# EAGLE design Adafruit MPU6050 (EAGLE 9.6.2)
COMPANY: ADAFRUIT INDUSTRIES; DRAWN: KTOWN; REV: A; YEAR: 2019
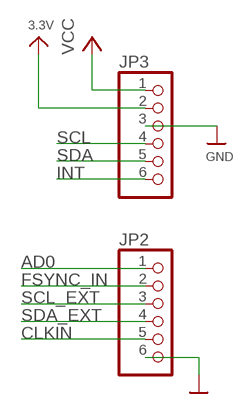
[diagram p0: schematic, sheet 1]

## Parts
JP2  HEADER-1X6ROUND  [1X06_ROUND]
JP3  HEADER-1X670MIL  [1X06_ROUND_70]

## Nets
3.3V: JP3.2
AD0: JP2.1
CLKIN: JP2.5
FSYNC_IN: JP2.2
GND: JP2.6 JP3.3
INT: JP3.6
SCL: JP3.4
SCL_EXT: JP2.3
SDA: JP3.5
SDA_EXT: JP2.4
VCC [highpower]: JP3.1

## Library data of the parts
JP2 JP3 = microbuilder:HEADER-1X6: PIN HEADER

## Net classes
1 highpower: width 0.406 mm, drill 0.483 mm
2 lowpower: width 0.305 mm, drill 0.483 mm

## Board
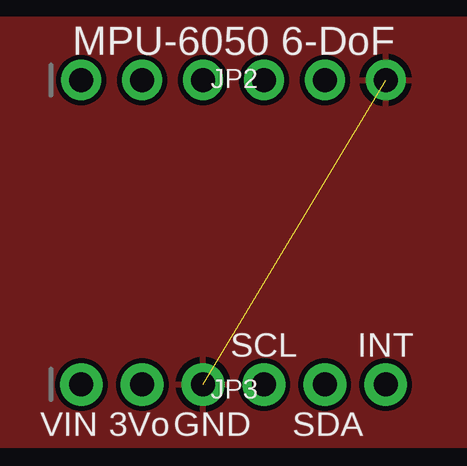
[diagram p1: board, top side]
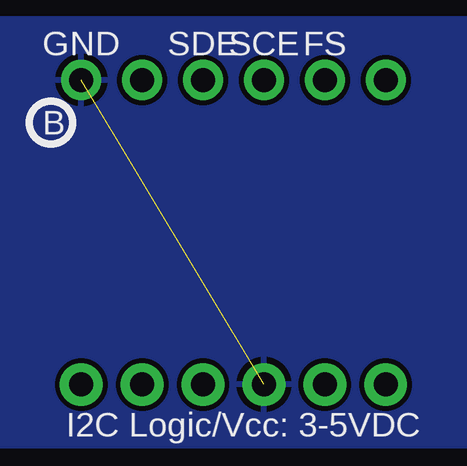
[diagram p2: board, bottom side, seen from below]

No outline drawn. Coordinates in mm, seen from the top.
Copper layers (1*16): Top 0.035mm / dielectric 1.5mm / Bottom 0.035mm
Design rules "adafruit 7-7": minimum track width 6mil, minimum drill 15.5mil, track to track 8mil, track to pad 7mil, pad to pad 7mil, via to via 7mil, smd to smd 7mil, copper to edge 10mil, drill to drill 8mil, minimum pad ring 10mil, minimum via ring 8mil, stop-mask expansion 2mil, vias tented up to drill 20mil, thermal gap 10mil

### Footprints (pad centres in the part's own frame; a part is rotated, then mirrored left to right if it is on the bottom)
1X06_ROUND = drill 1 pad 1.676: 1 -6.35,0; 2 -3.81,0; 3 -1.27,0; 4 1.27,0; 5 3.81,0; 6 6.35,0
1X06_ROUND_70 = drill 1 pad 1.778: 1 -6.35,0; 2 -3.81,0; 3 -1.27,0; 4 1.27,0; 5 3.81,0; 6 6.35,0

### Placement (x,y rotation side)
JP2  12.7,15.24 0 top
JP3  12.7,2.54 0 top
U$46  [PCBFEAT-REV-040]  20.32,13.46 0 bottom
U$47  [STEMMAQT]  22.48,4.45 90 bottom
U$48  [STEMMAQT]  2.92,13.34 270 bottom

### Tracks (layer width: path | path; a pad name or v marks a point on that pad's centre or on a via)
GND  (1 unrouted)
  pour Top: 0,17.78 25.4,17.78 25.4,0 0,0
  pour Bottom: 0,17.78 25.4,17.78 25.4,0 0,0

### Text on the board
tPlace: MPU-6050 6-DoF | SCL | INT | VIN | 3Vo | GND | SDA
bPlace: FS | SCE | SDE | GND | I2C Logic/Vcc: 3-5VDC